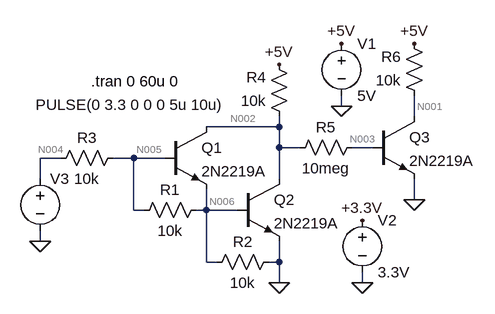
[diagram p0: schematic buffer_3V3_5V.asc]
buffer_3V3_5V.asc, the LTspice schematic file:
Version 4
SHEET 1 880 680
WIRE 336 64 336 48
WIRE 448 80 448 48
WIRE 240 96 240 80
WIRE 240 96 128 96
WIRE 240 128 240 96
WIRE 272 128 240 128
WIRE 384 128 352 128
WIRE -96 144 -128 144
WIRE 16 144 -16 144
WIRE 64 144 16 144
WIRE -128 176 -128 144
WIRE 240 176 240 128
WIRE 448 208 448 176
WIRE 16 224 16 144
WIRE 32 224 16 224
WIRE 128 224 128 192
WIRE 128 224 112 224
WIRE 176 224 128 224
WIRE -128 272 -128 256
WIRE 128 304 128 224
WIRE 144 304 128 304
WIRE 240 304 240 272
WIRE 240 304 224 304
WIRE 240 336 240 304
WIRE 368 336 368 320
FLAG 336 64 0
FLAG 336 -32 +5V
FLAG 368 336 0
FLAG 368 240 +3.3V
FLAG -128 272 0
FLAG 240 0 +5V
FLAG 240 336 0
FLAG 448 208 0
FLAG 448 -32 +5V
SYMBOL npn 64 96 R0
SYMATTR InstName Q1
SYMATTR Value 2N2219A
SYMBOL npn 176 176 R0
SYMATTR InstName Q2
SYMATTR Value 2N2219A
SYMBOL res 128 208 R90
WINDOW 0 0 56 VBottom 2
WINDOW 3 32 56 VTop 2
SYMATTR InstName R1
SYMATTR Value 10k
SYMBOL res 240 288 R90
WINDOW 0 0 56 VBottom 2
WINDOW 3 32 56 VTop 2
SYMATTR InstName R2
SYMATTR Value 10k
SYMBOL res 0 128 R90
WINDOW 0 0 56 VBottom 2
WINDOW 3 32 56 VTop 2
SYMATTR InstName R3
SYMATTR Value 10k
SYMBOL res 256 96 R180
WINDOW 0 36 76 Left 2
WINDOW 3 36 40 Left 2
SYMATTR InstName R4
SYMATTR Value 10k
SYMBOL voltage 336 -48 R0
SYMATTR InstName V1
SYMATTR Value 5V
SYMBOL voltage 368 224 R0
SYMATTR InstName V2
SYMATTR Value 3.3V
SYMBOL voltage -128 160 R0
WINDOW 0 15 16 Left 2
WINDOW 3 -7 -98 Left 2
WINDOW 123 0 0 Left 2
WINDOW 39 0 0 Left 2
SYMATTR InstName V3
SYMATTR Value PULSE(0 3.3 0 0 0 5u 10u)
SYMATTR Value2 ""
SYMATTR SpiceLine ""
SYMBOL npn 384 80 R0
SYMATTR InstName Q3
SYMATTR Value 2N2219A
SYMBOL res 368 112 R90
WINDOW 0 0 56 VBottom 2
WINDOW 3 32 56 VTop 2
SYMATTR InstName R5
SYMATTR Value 10meg
SYMBOL res 464 64 R180
WINDOW 0 36 76 Left 2
WINDOW 3 36 40 Left 2
SYMATTR InstName R6
SYMATTR Value 10k
TEXT -50 26 Left 2 !.tran 0 60u 0

The netlist it stands for:
* buffer_3V3_5V.asc
Q1 N002 N005 N006 0 2N2219A
Q2 N002 N006 0 0 2N2219A
R1 N006 N005 10k
R2 0 N006 10k
R3 N005 N004 10k
R4 N002 +5V 10k
V1 +5V 0 5V
V2 +3.3V 0 3.3V
V3 N004 0 PULSE(0 3.3 0 0 0 5u 10u)
Q3 N001 N003 0 0 2N2219A
R5 N003 N002 10meg
R6 N001 +5V 10k
.model NPN NPN
.model PNP PNP
.lib standard.bjt
.tran 0 60u 0
.backanno
.end

* Results of the author's LTspice run, read from the files saved beside the schematic
* Operating Point, zero values left out:
*   V(n002) = 4.996 V
*   V(n005) = 50.03 nV
*   V(n006) = 50.08 nV
*   V(+5v) = 5 V
*   V(+3.3v) = 3.3 V
*   V(n001) = 4.523 V
*   V(n003) = 565.8 mV
*   Ic(Q3) = 47.72 µA
*   Ib(Q3) = 443 nA
*   Ie(Q3) = -48.16 µA
*   Ic(Q2) = 5.012 pA
*   Ib(Q2) = -4.998 pA
*   Ic(Q1) = 5.012 pA
*   Ib(Q1) = -4.998 pA
*   I(R6) = -47.72 µA
*   I(R5) = -443 nA
*   I(R4) = -443 nA
*   I(R3) = 5.003 pA
*   I(R2) = -5.008 pA
*   I(V3) = 5.003 pA
*   I(V1) = -48.16 µA
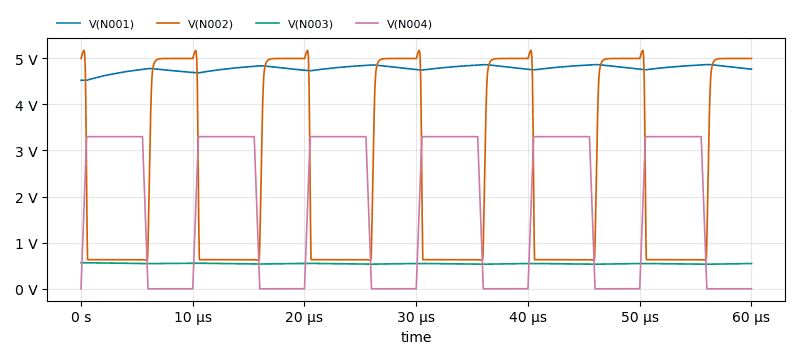
[diagram p1: Transient Analysis of buffer_3V3_5V.asc, plotted from the saved traces]
* Transient Analysis, 1 run:
*   V(N001): min 4.522 V, max 4.865 V, average 4.783 V, rms 4.783 V, last 4.764 V
*   V(N002): min 619.1 mV, max 5.172 V, average 2.514 V, rms 3.287 V, last 4.996 V
*   V(N003): min 533 mV, max 565.8 mV, average 544.4 mV, rms 544.4 mV, last 547.6 mV
*   V(N004): min 0 V, max 3.3 V, average 1.815 V, rms 2.41 V, last 0 V